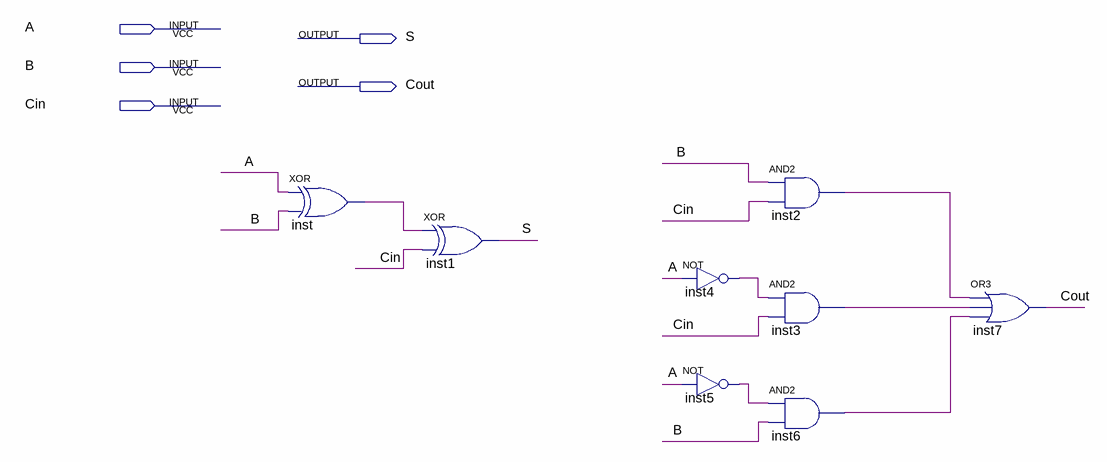
[diagram p0: schematic sheet]
// Quartus schematic subtrator_completo.bdf as structural Verilog: 8 symbols, 5 pins
module subtrator_completo (
  input  A,
  input  B,
  input  Cin,
  output S,
  output Cout
);

  wire inst2_out, inst3_out, inst4_out, inst5_out, inst6_out, inst_out;

  xor inst (inst_out, A, B);
  xor inst1 (S, inst_out, Cin);
  not inst4 (inst4_out, A);
  not inst5 (inst5_out, A);
  and inst2 (inst2_out, B, Cin);
  and inst3 (inst3_out, inst4_out, Cin);
  and inst6 (inst6_out, inst5_out, B);
  or inst7 (Cout, inst2_out, inst3_out, inst6_out);
endmodule
